# Altium schematic sheet SPItoRS422.SchDoc: Sample Sheet Title
size B; Date: MM/DD/YYYY; Author: Sample Author; Organization: ORGANIZATION; Address1: ADDRESS 1; Address2: ADDRESS 2; Address3: ADDRESS 3; Address4: ADDRESS 4; Revision: -; SheetNumber: 2; SheetTotal: 2; ENG_APP_DATE: --/--/--; DSN_APP_DATE: --/--/--; CHK_APP_DATE: --/--/--
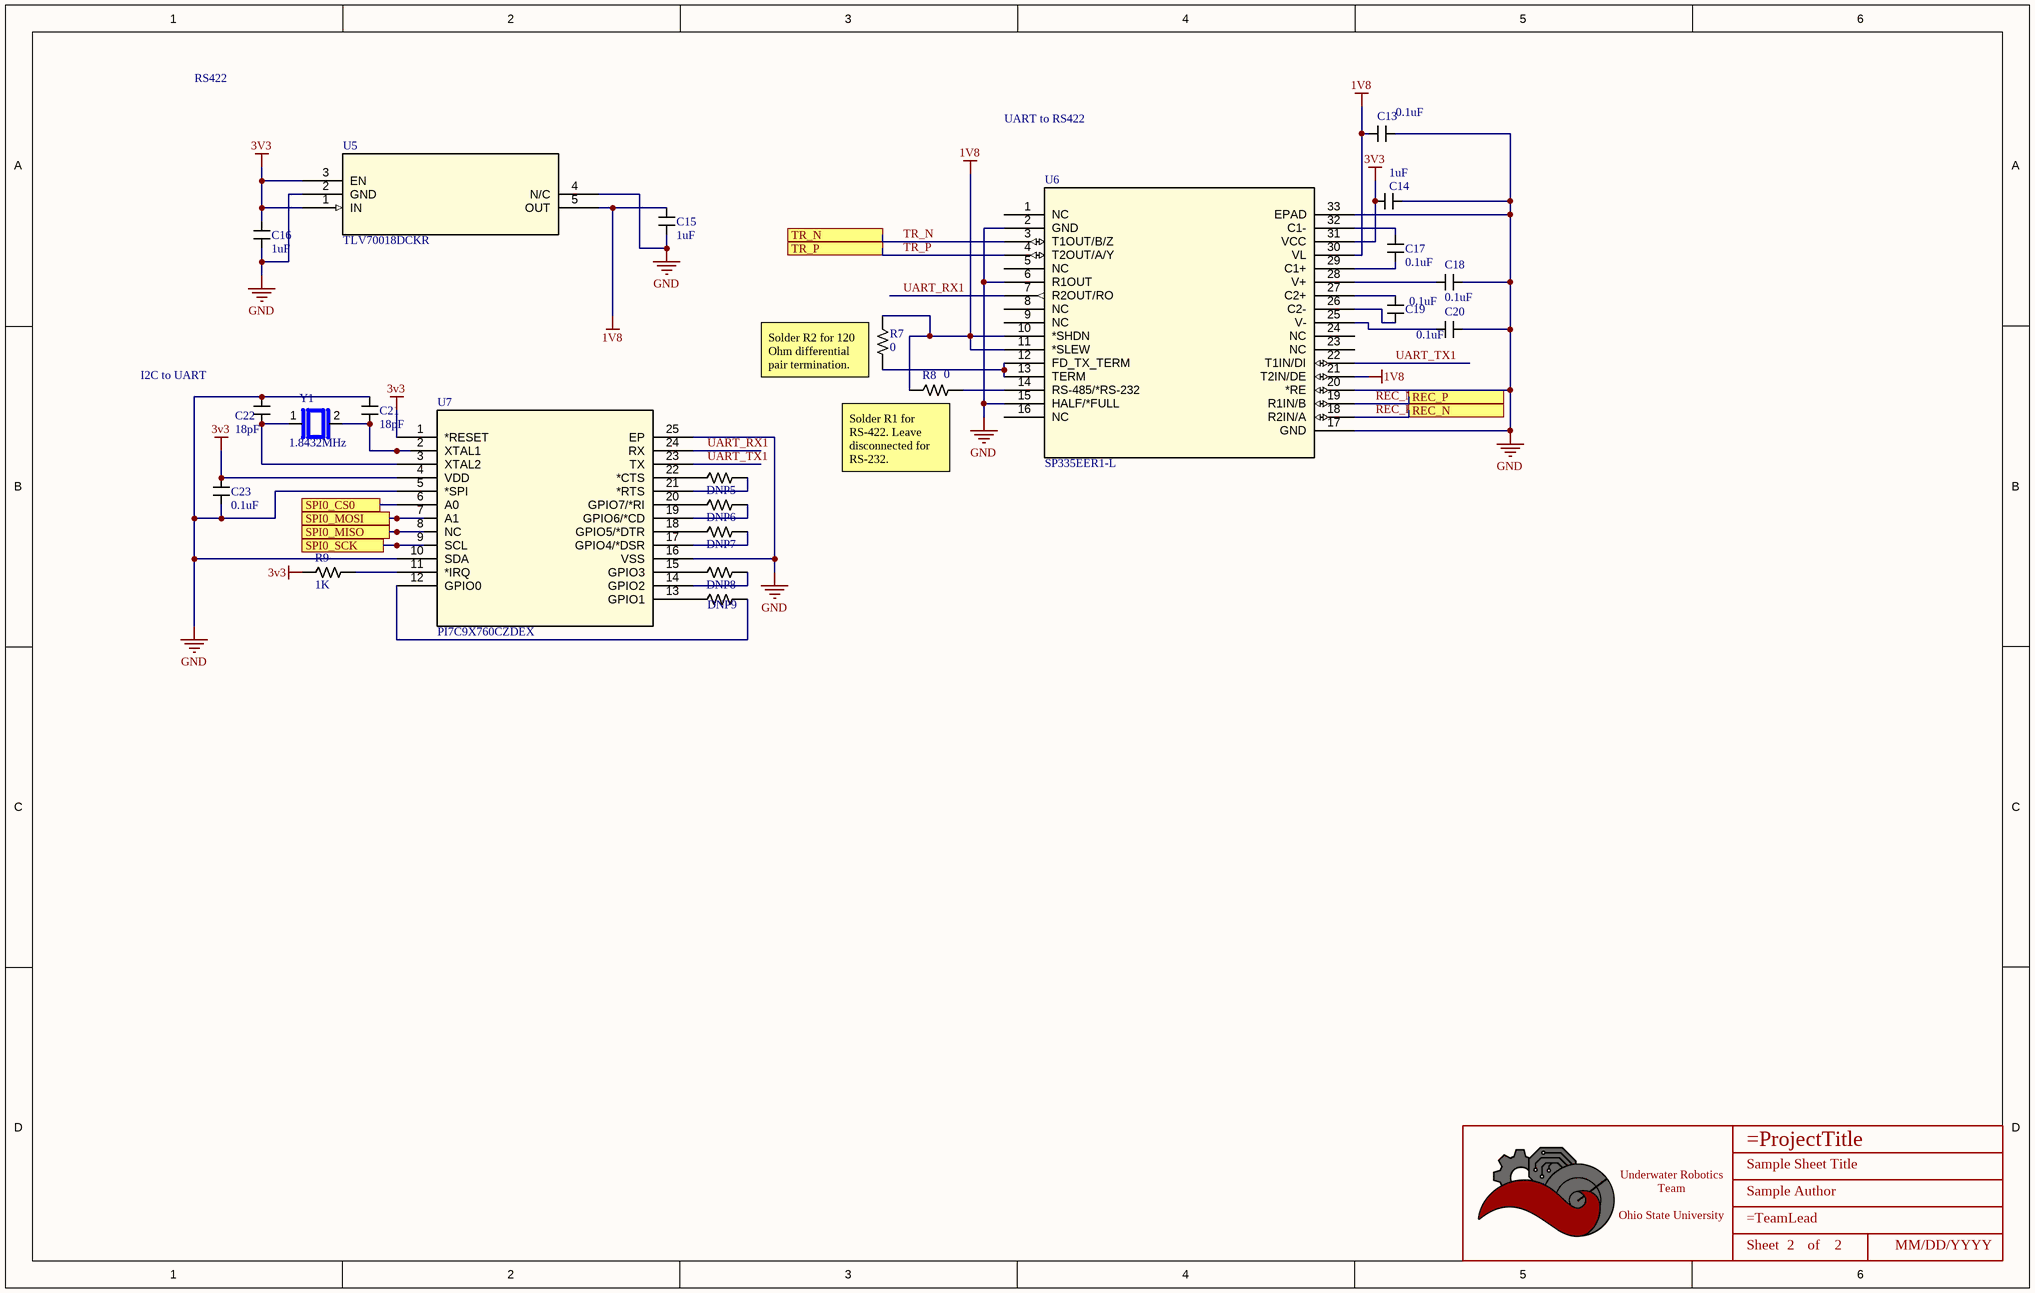
[diagram p0: SPItoRS422.SchDoc]

## Parts
*  Title_Block  [LOGO]  (value not drawn)  (graphical)
C13  value 0.1uF  [CAPACITOR_0402]  (hidden comment: 100nF Ceramic 25V)
C14  value 1uF  [CAPACITOR_0402]  (hidden comment: 1uF Ceramic 16V)
C15  value 1uF  [CAPACITOR_0402]  (hidden comment: 1uF Ceramic 16V)
C16  value 1uF  [CAPACITOR_0402]  (hidden comment: 1uF Ceramic 16V)
C17  value 0.1uF  [CAPACITOR_0402]  (hidden comment: 100nF Ceramic 25V)
C18  value 0.1uF  [CAPACITOR_0402]  (hidden comment: 100nF Ceramic 25V)
C19  value 0.1uF  [CAPACITOR_0402]  (hidden comment: 100nF Ceramic 25V)
C20  value 0.1uF  [CAPACITOR_0402]  (hidden comment: 100nF Ceramic 25V)
C21  value 18pF  [CAPACITOR_0603]  (hidden comment: 18pF Ceramic 50V)
C22  value 18pF  [CAPACITOR_0603]  (hidden comment: 18pF Ceramic 50V)
C23  value 0.1uF  [CAPACITOR_0402]  (hidden comment: 100nF Ceramic 25V)
DNP5  DNP  [RESISTOR_0402]  (value not drawn)
DNP6  DNP  [RESISTOR_0402]  (value not drawn)
DNP7  DNP  [RESISTOR_0402]  (value not drawn)
DNP8  DNP  [RESISTOR_0402]  (value not drawn)
DNP9  DNP  [RESISTOR_0402]  (value not drawn)
R7  Value  (Ohms): 0  [RESISTOR_0402]  (hidden comment: 0 Ohm 1% 1/16W)
R8  Value  (Ohms): 0  [RESISTOR_0402]  (hidden comment: 0 Ohm 1% 1/16W)
R9  Value  (Ohms): 1K  [RESISTOR_0402]  (hidden comment: 1k Ohm 1% 1/16W)
U5  TLV70018DCKR  [SOT-353]
U6  SP335EER1-L  [QFN-32]
U7  PI7C9X760CZDEX  [TQFN-24]
Y1  1.8432MHz  [2-SMD (8x3.7)]

## Ports
REC_N, REC_P, SPI0_CS0, SPI0_MISO, SPI0_MOSI, SPI0_SCK, TR_N, TR_P

## Nets
1V8: C13.1 C15.1 R7.2 R8.2 U5.5(OUT) U6.10(*SHDN) U6.11(*SLEW) U6.21(T2IN/DE) U6.30(VL)
3V3: C14.1 C16.1 C23.1 R9.2 U5.1(IN) U5.3(EN) U6.31(VCC) U7.1(*RESET) U7.4(VDD)
GND: C13.2 C14.2 C15.2 C16.2 C18.2 C20.2 C21.1 C22.1 C23.2 U5.2(GND) U5.4(N/C) U6.2(GND) U6.6(R1OUT) U6.15(HALF/*FULL) U6.17(GND) U6.20(*RE) U6.33(EPAD) U7.5(*SPI) U7.10(SDA) U7.16(VSS) U7.25(EP)
REC_N: U6.19(R1IN/B) ; port REC_P
REC_P: U6.18(R2IN/A) ; port REC_N
SPI0_CS0: U7.6(A0) ; port SPI0_CS0
SPI0_MISO: U7.8(NC) ; port SPI0_MISO
SPI0_MOSI: U7.7(A1) ; port SPI0_MOSI
SPI0_SCK: U7.9(SCL) ; port SPI0_SCK
TR_N: U6.3(T1OUT/B/Z) ; port TR_N
TR_P: U6.4(T2OUT/A/Y) ; port TR_P
UART_RX1: U6.7(R2OUT/RO) U7.24(RX)
UART_TX1: U6.22(T1IN/DI) U7.23(TX)
NetC17_1: C17.1 U6.32(C1-)
NetC17_2: C17.2 U6.29(C1+)
NetC18_1: C18.1 U6.28(V+)
NetC19_1: C19.1 U6.27(C2+)
NetC19_2: C19.2 U6.26(C2-)
NetC20_1: C20.1 U6.25(V-)
NetC21_2: C21.2 U7.2(XTAL1) Y1.2
NetC22_2: C22.2 U7.3(XTAL2) Y1.1
NetDNP5_1: DNP5.1 U7.21(*RTS)
NetDNP5_2: DNP5.2 U7.22(*CTS)
NetDNP6_1: DNP6.1 U7.19(GPIO6/*CD)
NetDNP6_2: DNP6.2 U7.20(GPIO7/*RI)
NetDNP7_1: DNP7.1 U7.17(GPIO4/*DSR)
NetDNP7_2: DNP7.2 U7.18(GPIO5/*DTR)
NetDNP8_1: DNP8.1 U7.14(GPIO2)
NetDNP8_2: DNP8.2 U7.15(GPIO3)
NetDNP9_1: DNP9.1 U7.12(GPIO0)
NetDNP9_2: DNP9.2 U7.13(GPIO1)
NetR7_1: R7.1 U6.12(FD_TX_TERM) U6.13(TERM)
NetR8_1: R8.1 U6.14(RS-485/*RS-232)
NetR9_1: R9.1 U7.11(*IRQ)

Not connected (* = marked no-connect by the designer): U6 1(NC) 5(NC) 8(NC) 9(NC) 16(NC) 23(NC) 24(NC)

## Notes on the sheet
- RS422
- UART to RS422
- (near R7) Solder R2 for 120 Ohm differential pair termination.
- I2C to UART
- (near R8) Solder R1 for RS-422. Leave disconnected for RS-232.
- DWG. NO.
- REV.
- SHT.
- THIS DOCUMENT AND THE DATA DISCLOSED HEREIN OR HEREWITH IS THE PROPERTY OF ALTIUM LIMITED AND MAY BE FREELY DISTRIBUTED IN WHOLE. NO RIGHTS ARE RESERVED OR EXPRESS OR IMPLIED WARANTEE GIVEN.
- REVISION
- DESCRIPTION
- DATE
- APPROVED
- ENG:
- APPROVALS
- PROJECT
- DSN:
- CHK:
- REFERENCE DOCUMENTS
- PROJECT REVISION:
- TITLE
- DOCUMENT REVISION:
- DESIGN ITEM:
- BOM:
- FAB DWG:
- PCB DWG:
- ASSY DWG:
- SCALE:
- SIZE
- B
- CAGE CODE
- FILE NAME
- DWG NO.
- SHEET
- OF
- REV
- (in symbol Title_Block) Underwater Robotics Team / Ohio State University; Sheet; of

## Library data of the parts
* = Title_Block: UWRT Schematic Title Block Template / Created June 2021, Dylan Trainor
C13 C17-C20 C23 = CAPACITOR_0.1uF_0402: Cap 100nF 25V +/-10% / Ceramic 0402; Made By: Robert Pafford; Tolerance: +/- 10%; Voltage: 25V; Supplier 1: Digi-Key; Supplier Part Number 1: 478-7868-1-ND
C14-C16 = CAPACITOR_1uF_0402: Cap 1uF 16V +/-10% / Ceramic 0402; Made By: Robert Pafford; Tolerance: +/- 10%; Voltage: 16V; Supplier 1: Digi-Key; Supplier Part Number 1: 478-0402YD105KAT4ADKR-ND
C21 C22 = CAPACITOR_0.000018uF_0603: Cap 18pF 50V +/-5% / Ceramic 0603; Made By: Flip B; ComponentLink1Description: Datsheet; ComponentLink1URL: https://www.mouser.com/datasheet/2/212/KEM_C1002_X7R_SMD-1102033.pdf; Tolerance: +/- 5%; Voltage: 50V; Supplier 1: Digi-Key; Supplier Part Number 1: 311-1061-1-ND
DNP5-DNP9 = DNP_0402: Do Not Populate 0402
R7 R8 = RESISTOR_0_0402: RES 0 OHM 1% 1/16W 0402; Tolerance: +/- 1%; Made By: Robert Pafford; Wattage: 1/16W; Supplier 1: Digikey; Supplier Part Number 1: 13-AC0402FR-070RLCT-ND
R9 = RESISTOR_1K_0402: RES 1k OHM 1% 1/16W 0402; Tolerance: +/- 1%; Made By: Robert Pafford; Wattage: 1/16W; Supplier: Digikey; Digikey Part Numer: CR0603-JW-104ELFTR-ND; Supplier 1: Digi-Key; Supplier Part Number 1: 13-AC0402FR-131KLCT-ND
U5 = TLV70018DCKR: Fixed Positive LDO Regulator, 1.8V, PMOS, PDSO5; Made By: Ethan Rosati; Max Voltage: 5.5 V; Min Voltage: 2 V; Output Current: 200 mA; Reviewed By: *; Output Voltage: 1.8 V; Supplier 1: Mouser; Supplier Part Number 1: 595-TLV70018DCKR
U6 = SP335EER1-L: 1/1, 2/2 Transceiver Full RS232, RS422, RS485 32-QFN (5x5); Supply Voltage: 3V - 5.5V; Created By: Ethan Rosati; Reviewed By: *; Supplier 1: Digikey; Supplier Part Number 1: 1016-1969-ND
U7 = PI7C9X760CZDEX: I2C Bridge, I2C/SPI to UART UART Interface 24-TQFN (4x4)
Y1 = CRYSTAL_1.8432MHz: CRYSTAL 1.8432MHZ 10PF SMD